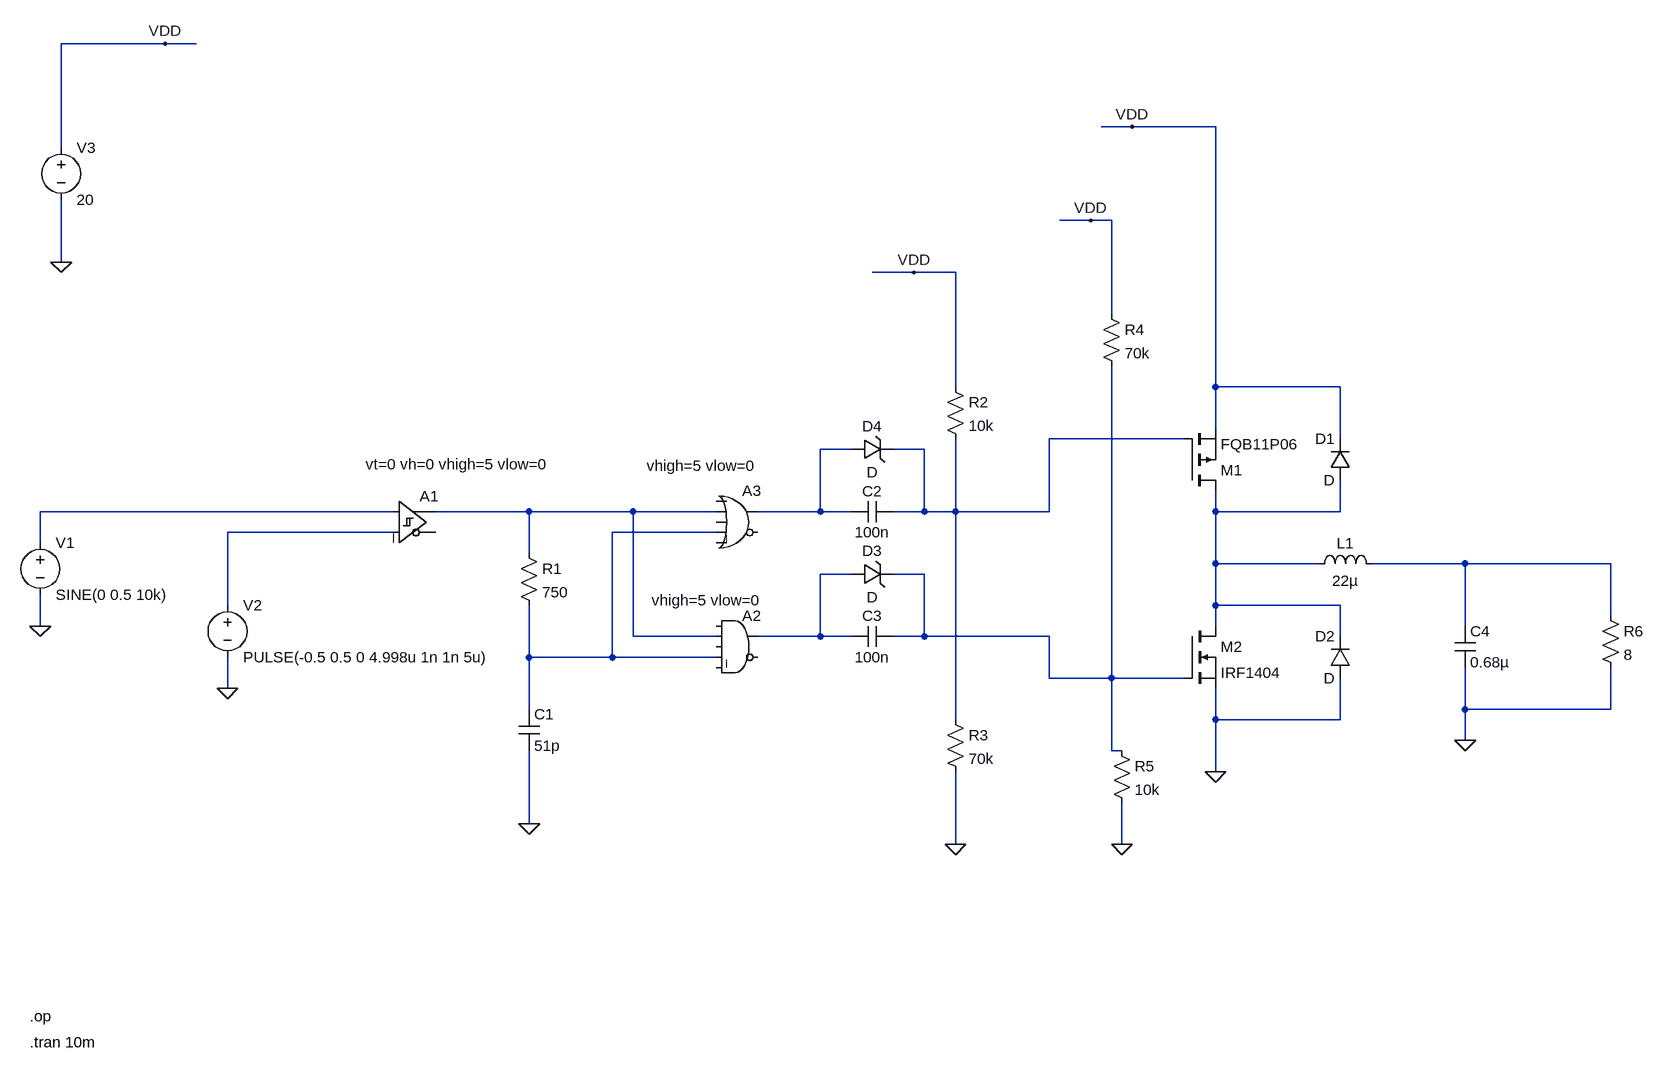
[diagram p0: schematic ClassDAmplifierWithProtection.asc]
ClassDAmplifierWithProtection.asc, the LTspice schematic file:
Version 4
SHEET 1 1764 1236
WIRE -1536 -672 -1696 -672
WIRE -1488 -672 -1536 -672
WIRE -48 -544 -96 -544
WIRE 80 -544 -48 -544
WIRE -1696 -512 -1696 -672
WIRE -112 -400 -160 -400
WIRE -80 -400 -112 -400
WIRE -1696 -336 -1696 -432
WIRE -384 -320 -448 -320
WIRE -320 -320 -384 -320
WIRE -80 -256 -80 -400
WIRE -320 -144 -320 -320
WIRE 80 -144 80 -544
WIRE 272 -144 80 -144
WIRE 80 -80 80 -144
WIRE 32 -64 -176 -64
WIRE 272 -64 272 -144
WIRE -480 -48 -528 -48
WIRE -368 -48 -416 -48
WIRE -1184 48 -1728 48
WIRE -976 48 -1120 48
WIRE -816 48 -976 48
WIRE -688 48 -816 48
WIRE -528 48 -528 -48
WIRE -528 48 -624 48
WIRE -480 48 -528 48
WIRE -368 48 -368 -48
WIRE -368 48 -416 48
WIRE -320 48 -320 -64
WIRE -320 48 -368 48
WIRE -176 48 -176 -64
WIRE -176 48 -320 48
WIRE 80 48 80 16
WIRE 272 48 272 0
WIRE 272 48 80 48
WIRE -1184 80 -1440 80
WIRE -688 80 -848 80
WIRE -1728 96 -1728 48
WIRE -976 112 -976 48
WIRE 80 128 80 48
WIRE 240 128 80 128
WIRE 464 128 320 128
WIRE 688 128 464 128
WIRE -480 144 -528 144
WIRE -368 144 -416 144
WIRE -1440 192 -1440 80
WIRE 80 192 80 128
WIRE 272 192 80 192
WIRE 688 208 688 128
WIRE -1728 224 -1728 176
WIRE 80 224 80 192
WIRE 464 224 464 128
WIRE -816 240 -816 48
WIRE -688 240 -816 240
WIRE -528 240 -528 144
WIRE -528 240 -624 240
WIRE -480 240 -528 240
WIRE -368 240 -368 144
WIRE -368 240 -416 240
WIRE -176 240 -368 240
WIRE 272 240 272 192
WIRE -976 272 -976 192
WIRE -848 272 -848 80
WIRE -848 272 -976 272
WIRE -688 272 -848 272
WIRE -176 304 -176 240
WIRE -80 304 -80 -176
WIRE -80 304 -176 304
WIRE 32 304 -80 304
WIRE -1440 320 -1440 272
WIRE -976 352 -976 272
WIRE 464 352 464 288
WIRE 688 352 688 288
WIRE 688 352 464 352
WIRE -320 368 -320 48
WIRE 80 368 80 320
WIRE 272 368 272 304
WIRE 272 368 80 368
WIRE 464 400 464 352
WIRE -80 416 -80 304
WIRE -64 416 -80 416
WIRE 80 448 80 368
WIRE -976 528 -976 416
WIRE -320 560 -320 448
WIRE -64 560 -64 496
FLAG -1440 320 0
FLAG -1728 224 0
FLAG -976 528 0
FLAG -1696 -336 0
FLAG -1536 -672 VDD
FLAG 80 448 0
FLAG -48 -544 VDD
FLAG -64 560 0
FLAG -320 560 0
FLAG -384 -320 VDD
FLAG -112 -400 VDD
FLAG 464 400 0
SYMBOL Digital\\diffschmitt -1184 0 R0
WINDOW 3 -43 -25 Left 2
SYMATTR Value vt=0 vh=0 vhigh=5 vlow=0
SYMATTR InstName A1
SYMBOL voltage -1728 80 R0
WINDOW 123 0 0 Left 0
WINDOW 39 0 0 Left 0
SYMATTR InstName V1
SYMATTR Value SINE(0 0.5 10k)
SYMBOL voltage -1440 176 R0
WINDOW 123 0 0 Left 0
WINDOW 39 0 0 Left 0
SYMATTR InstName V2
SYMATTR Value PULSE(-0.5 0.5 0 4.998u 1n 1n 5u)
SYMBOL Digital\\and -656 192 R0
WINDOW 3 -131 -8 Left 2
SYMATTR Value vhigh=5 vlow=0
SYMATTR InstName A2
SYMBOL Digital\\or -656 0 R0
WINDOW 3 -139 -23 Left 2
SYMATTR Value vhigh=5 vlow=0
SYMATTR InstName A3
SYMBOL res -992 96 R0
SYMATTR InstName R1
SYMATTR Value 750
SYMBOL cap -992 352 R0
SYMATTR InstName C1
SYMATTR Value 51p
SYMBOL voltage -1696 -528 R0
WINDOW 123 0 0 Left 0
WINDOW 39 0 0 Left 0
SYMATTR InstName V3
SYMATTR Value 20
SYMBOL cap -416 32 R90
WINDOW 0 0 32 VBottom 2
WINDOW 3 32 32 VTop 2
SYMATTR InstName C2
SYMATTR Value 100n
SYMBOL pmos 32 16 M180
SYMATTR InstName M1
SYMATTR Value FQB11P06
SYMBOL nmos 32 224 R0
SYMATTR InstName M2
SYMATTR Value IRF1404
SYMBOL res -336 -160 R0
SYMATTR InstName R2
SYMATTR Value 10k
SYMBOL res -336 352 R0
SYMATTR InstName R3
SYMATTR Value 70k
SYMBOL res -96 -272 R0
SYMATTR InstName R4
SYMATTR Value 70k
SYMBOL res -80 400 R0
SYMATTR InstName R5
SYMATTR Value 10k
SYMBOL ind 224 144 R270
WINDOW 0 32 56 VTop 2
WINDOW 3 5 56 VBottom 2
SYMATTR InstName L1
SYMATTR Value 22µ
SYMBOL cap 448 224 R0
SYMATTR InstName C4
SYMATTR Value 0.68µ
SYMBOL res 672 192 R0
SYMATTR InstName R6
SYMATTR Value 8
SYMBOL diode 288 0 R180
WINDOW 0 24 64 Left 2
WINDOW 3 24 0 Left 2
SYMATTR InstName D1
SYMBOL diode 288 304 R180
WINDOW 0 24 64 Left 2
WINDOW 3 24 0 Left 2
SYMATTR InstName D2
SYMBOL cap -416 224 R90
WINDOW 0 0 32 VBottom 2
WINDOW 3 32 32 VTop 2
SYMATTR InstName C3
SYMATTR Value 100n
SYMBOL zener -480 160 R270
WINDOW 0 36 32 VTop 2
WINDOW 3 -4 32 VBottom 2
SYMATTR InstName D3
SYMBOL zener -480 -32 R270
WINDOW 0 36 32 VTop 2
WINDOW 3 -4 32 VBottom 2
SYMATTR InstName D4
TEXT -1744 824 Left 2 !.op
TEXT -1744 864 Left 2 !.tran 10m

The netlist it stands for:
* ClassDAmplifierWithProtection.asc
A1 N003 N006 0 0 0 0 N004 0 SCHMITT vt=0 vh=0 vhigh=5 vlow=0
V1 N003 0 SINE(0 0.5 10k)
V2 N006 0 PULSE(-0.5 0.5 0 4.998u 1n 1n 5u)
A2 0 N004 0 N007 0 0 N009 0 AND vhigh=5 vlow=0
A3 0 N004 0 N007 0 0 N002 0 OR vhigh=5 vlow=0
R1 N004 N007 750
C1 N007 0 51p
V3 VDD 0 20
C2 N001 N002 100n
M1 N005 N001 VDD VDD FQB11P06
M2 N005 N010 0 0 IRF1404
R2 VDD N001 10k
R3 N001 0 70k
R4 VDD N010 70k
R5 N010 0 10k
L1 N005 N008 22µ
C4 N008 0 0.68µ
R6 N008 0 8
D1 N005 VDD D
D2 0 N005 D
C3 N010 N009 100n
D3 N009 N010 D
D4 N002 N001 D
.model D D
.lib standard.dio
.model NMOS NMOS
.model PMOS PMOS
.lib standard.mos
.op
.tran 10m
.backanno
.end